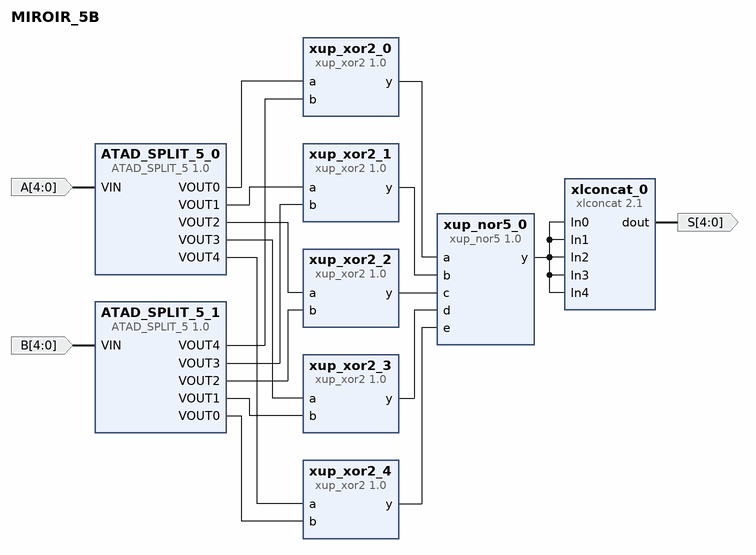
[diagram p0: block diagram of the top level]
# Vivado block design MIROIR_5B, xc7a100tcsg324-1, Vivado 2019.1
create_bd_design MIROIR_5B

create_bd_port -dir I -from 4 -to 0 A
create_bd_port -dir I -from 4 -to 0 B
create_bd_port -dir O -from 4 -to 0 S

create_bd_cell -type ip -vlnv xilinx.com:xup:xup_xor2:1.0 xup_xor2_0
create_bd_cell -type ip -vlnv xilinx.com:xup:xup_xor2:1.0 xup_xor2_1
create_bd_cell -type ip -vlnv xilinx.com:xup:xup_xor2:1.0 xup_xor2_2
create_bd_cell -type ip -vlnv xilinx.com:xup:xup_xor2:1.0 xup_xor2_3
create_bd_cell -type ip -vlnv xilinx.com:xup:xup_xor2:1.0 xup_xor2_4
create_bd_cell -type ip -vlnv xilinx.com:user:ATAD_SPLIT_5:1.0 ATAD_SPLIT_5_0
create_bd_cell -type ip -vlnv xilinx.com:user:ATAD_SPLIT_5:1.0 ATAD_SPLIT_5_1
create_bd_cell -type ip -vlnv xilinx.com:xup:xup_nor5:1.0 xup_nor5_0
create_bd_cell -type ip -vlnv xilinx.com:ip:xlconcat:2.1 xlconcat_0
set_property -dict {CONFIG.NUM_PORTS 5} [get_bd_cells xlconcat_0]

# ---- connections ----

connect_bd_net [get_bd_ports B] [get_bd_pins ATAD_SPLIT_5_1/VIN]
connect_bd_net [get_bd_ports A] [get_bd_pins ATAD_SPLIT_5_0/VIN]
connect_bd_net [get_bd_pins ATAD_SPLIT_5_0/VOUT0] [get_bd_pins xup_xor2_0/a]
connect_bd_net [get_bd_pins ATAD_SPLIT_5_0/VOUT1] [get_bd_pins xup_xor2_1/a]
connect_bd_net [get_bd_pins ATAD_SPLIT_5_0/VOUT2] [get_bd_pins xup_xor2_2/a]
connect_bd_net [get_bd_pins ATAD_SPLIT_5_0/VOUT3] [get_bd_pins xup_xor2_3/a]
connect_bd_net [get_bd_pins ATAD_SPLIT_5_0/VOUT4] [get_bd_pins xup_xor2_4/a]
connect_bd_net [get_bd_pins ATAD_SPLIT_5_1/VOUT0] [get_bd_pins xup_xor2_4/b]
connect_bd_net [get_bd_pins ATAD_SPLIT_5_1/VOUT1] [get_bd_pins xup_xor2_3/b]
connect_bd_net [get_bd_pins ATAD_SPLIT_5_1/VOUT2] [get_bd_pins xup_xor2_2/b]
connect_bd_net [get_bd_pins ATAD_SPLIT_5_1/VOUT3] [get_bd_pins xup_xor2_1/b]
connect_bd_net [get_bd_pins ATAD_SPLIT_5_1/VOUT4] [get_bd_pins xup_xor2_0/b]
connect_bd_net [get_bd_pins xup_xor2_0/y] [get_bd_pins xup_nor5_0/a]
connect_bd_net [get_bd_pins xup_xor2_1/y] [get_bd_pins xup_nor5_0/b]
connect_bd_net [get_bd_pins xup_xor2_2/y] [get_bd_pins xup_nor5_0/c]
connect_bd_net [get_bd_pins xup_xor2_3/y] [get_bd_pins xup_nor5_0/d]
connect_bd_net [get_bd_pins xup_xor2_4/y] [get_bd_pins xup_nor5_0/e]
connect_bd_net [get_bd_pins xup_nor5_0/y] \
  [get_bd_pins xlconcat_0/In0] [get_bd_pins xlconcat_0/In1] [get_bd_pins xlconcat_0/In2] [get_bd_pins xlconcat_0/In3] \
  [get_bd_pins xlconcat_0/In4]
connect_bd_net [get_bd_pins xlconcat_0/dout] [get_bd_ports S]

validate_bd_design
save_bd_design
